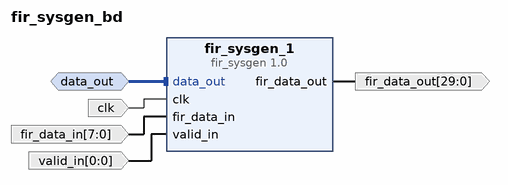
[diagram p0: block diagram of the top level]
# Vivado block design fir_sysgen_bd, xc7s50csga324-2, Vivado 2018.3
create_bd_design fir_sysgen_bd

create_bd_intf_port -mode Slave -vlnv xilinx.com:interface:axis_rtl:1.0 data_out
set_property -dict [list \
  CONFIG.HAS_TKEEP 0 \
  CONFIG.HAS_TLAST 0 \
  CONFIG.HAS_TREADY 1 \
  CONFIG.HAS_TSTRB 0 \
  CONFIG.LAYERED_METADATA undef \
  CONFIG.TDATA_NUM_BYTES 0 \
  CONFIG.TDEST_WIDTH 0 \
  CONFIG.TID_WIDTH 0 \
  CONFIG.TUSER_WIDTH 0 \
] [get_bd_intf_ports data_out]
create_bd_port -dir I -type clk clk
create_bd_port -dir I -from 7 -to 0 -type data fir_data_in
create_bd_port -dir O -from 29 -to 0 -type data fir_data_out
create_bd_port -dir I -from 0 -to 0 -type data valid_in

create_bd_cell -type ip -vlnv User_Company:SysGen:fir_sysgen:1.0 fir_sysgen_1

# ---- connections ----

connect_bd_intf_net [get_bd_intf_ports data_out] [get_bd_intf_pins fir_sysgen_1/data_out]
connect_bd_net [get_bd_ports clk] [get_bd_pins fir_sysgen_1/clk]
connect_bd_net [get_bd_ports fir_data_in] [get_bd_pins fir_sysgen_1/fir_data_in]
connect_bd_net [get_bd_pins fir_sysgen_1/fir_data_out] [get_bd_ports fir_data_out]
connect_bd_net [get_bd_ports valid_in] [get_bd_pins fir_sysgen_1/valid_in]

validate_bd_design
save_bd_design
